# EAGLE design PSD5V (EAGLE 9.6.2)
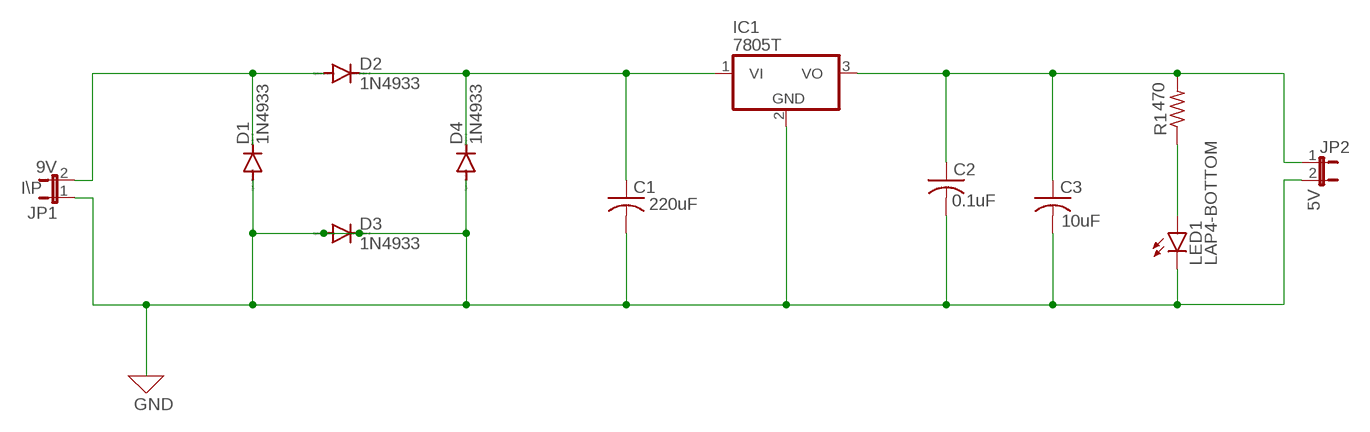
[diagram p0: schematic, sheet 1]

## Parts
C1  C-US025-024X044  [C025-024X044]
C2  C-US025-024X044  [C025-024X044]
C3  C-US025-024X044  [C025-024X044]
D1  1N4933  [DO41-10]
D2  1N4933  [DO41-10]
D3  1N4933  [DO41-10]
D4  1N4933  [DO41-10]
IC1  7805T  [TO220H]
JP1  JP1E  [JP1]
JP2  JP1E  [JP1]
LED1  LAP4-BOTTOM  [P47F-BOTTOM]
R1  R-US_0204/7  [0204/7]

## Nets
0: C1.2 C2.2 C3.2 D1.A D3.A D3.C D4.A IC1.2(GND) JP1.1 JP2.2 LED1.C ; supply symbol labelled GND
N$1: D1.C D2.A JP1.2
N$2: LED1.A R1.1
N$4: C2.1 C3.1 IC1.3(VO) JP2.1 R1.2
N$5: C1.1 D2.C D4.C IC1.1(VI)

## Notes on the sheet
- 470
- 9V
- I\P
- 220uF | 0.1uF | 5V
- 10uF
- GND

## Library data of the parts
C1-C3 = rcl:C-US: CAPACITOR, American symbol; SPICEPREFIX: C
D1-D4 = diode:1N4933: DIODE fast recovery rectifier, 1A
IC1 = linear:78*: Positive VOLTAGE REGULATOR Source: http://cache.national.com/ds/LM/LM78L05.pdf http://www.fairchildsemi.com/ds/LM/LM7805.pdf
JP1 JP2 = jumper:JP1E: JUMPER
LED1 = led:*P4: PointLED® Enhanced Thinfilm LED TOP & BOTTOM mount LS P47F, LR P47F, LA P47F, LY P47F, LT P4SG, LB P4SG, LW P4SG Source: http://catalog.osram-os.com .. LA_LR_LS_LY_P47F_Pb_free.pdf
R1 = rcl:R-US_: RESISTOR, American symbol; SPICEPREFIX: R

## Board
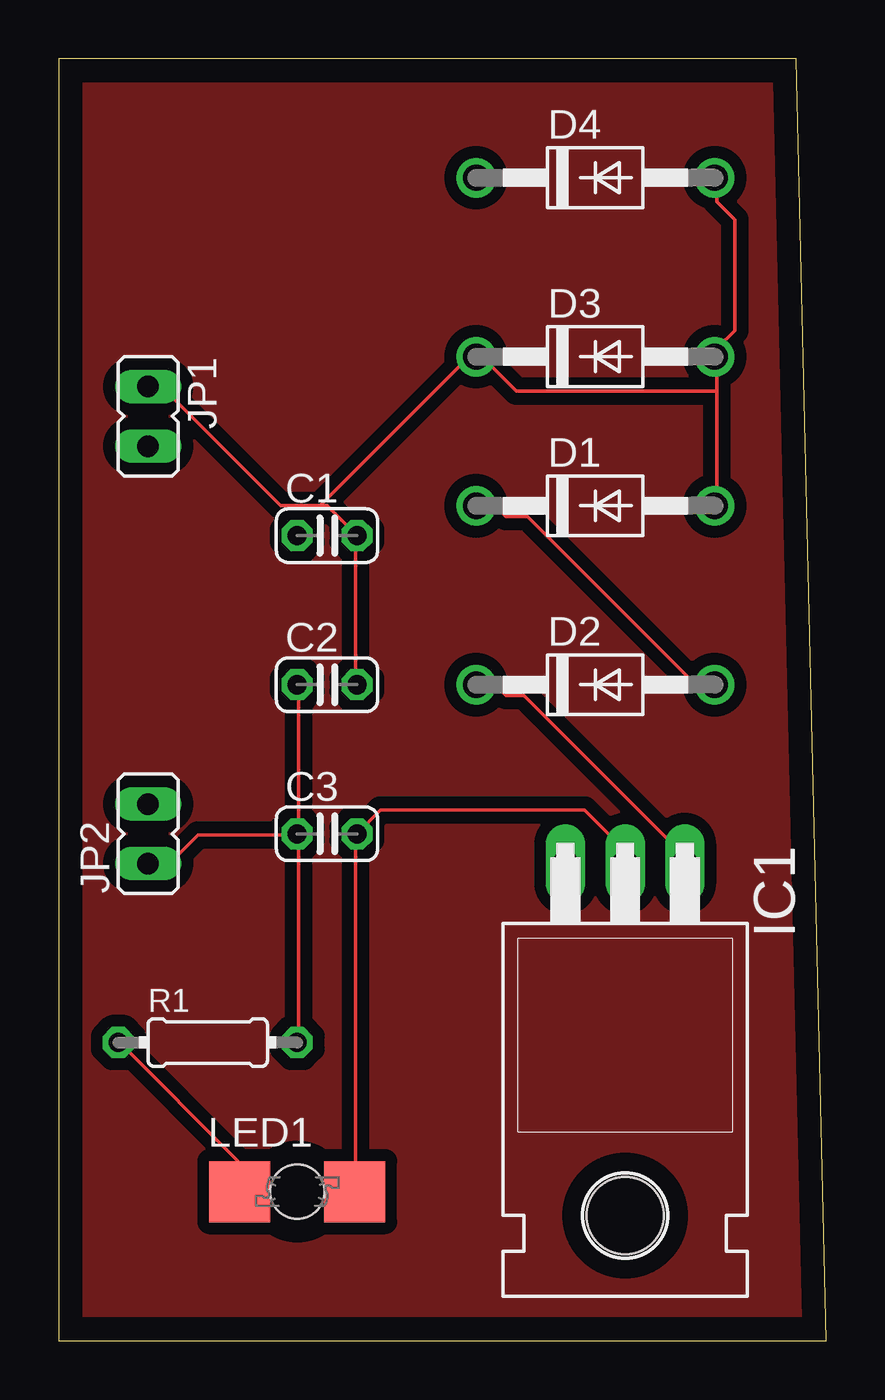
[diagram p1: board, top side]
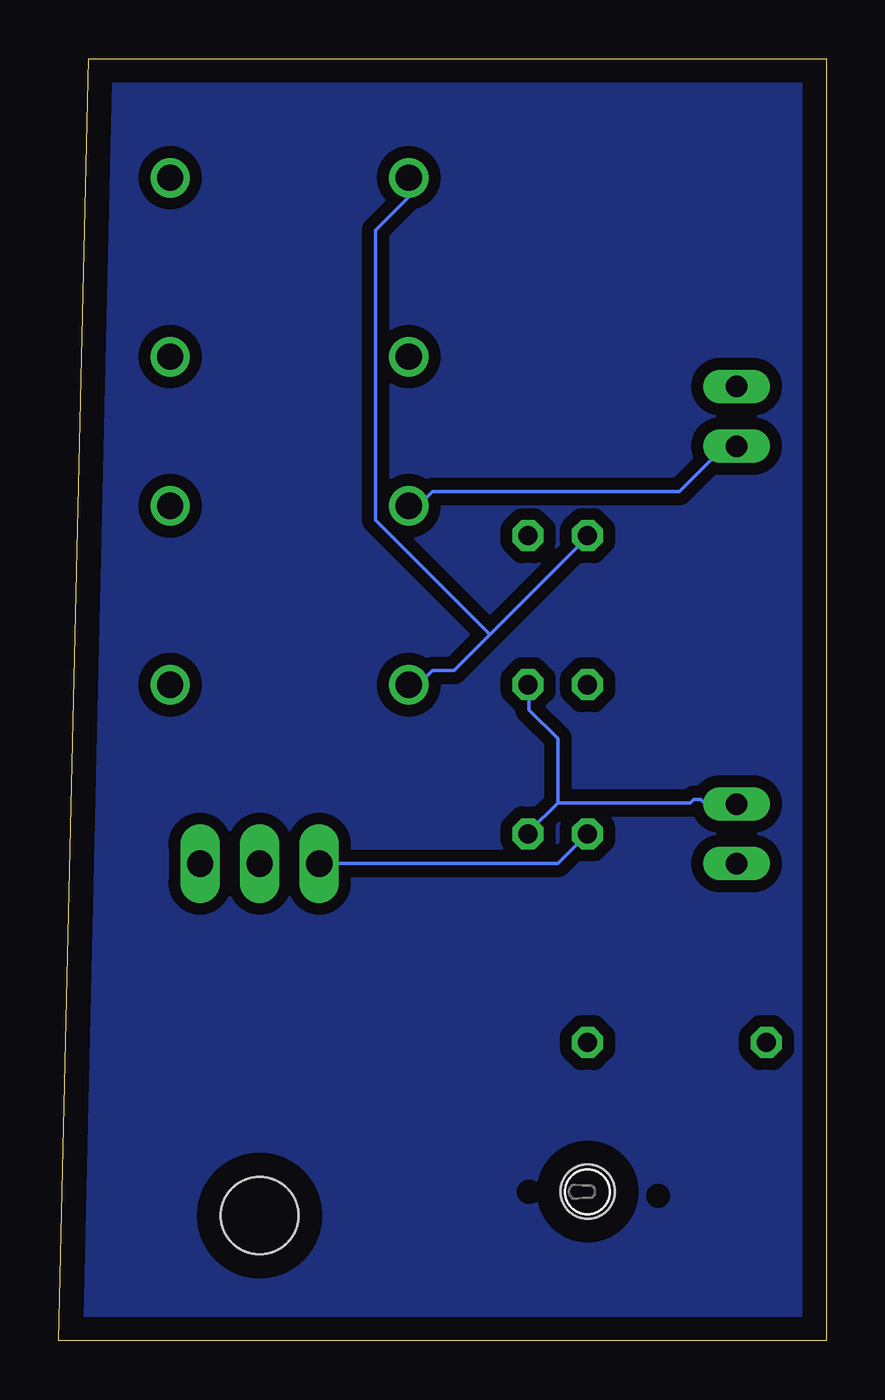
[diagram p2: board, bottom side, seen from below]

Size 32.69 x 54.6 mm. Coordinates in mm from the lower left corner, seen from the top.
Outline: 0,0 32.69,0 31.42,54.6 0,54.6 0,0
Copper layers (1*16): Top 0.035mm / dielectric 1.5mm / Bottom 0.035mm
Design rules "default *": minimum track width 6mil, minimum drill 0.35mm, track to track 20mil, track to pad 20mil, pad to pad 20mil, via to via 20mil, smd to smd 6mil, copper to edge 40mil, drill to drill 6mil, minimum pad ring 10mil, minimum via ring 8mil, stop-mask expansion 4mil, vias tented up to drill 0mil, thermal gap 10mil

### Footprints (pad centres in the part's own frame; a part is rotated, then mirrored left to right if it is on the bottom)
C025-024X044 = drill 0.813 octagon: 1 -1.27,0; 2 1.27,0
DO41-10 = drill 1.118: A 5.08,0; C -5.08,0
TO220H = drill 1.118 long: 1 -2.54,-10.16; 2 0,-10.16; 3 2.54,-10.16 | hole 3.302: 0,4.826
JP1 = drill 0.914 long: 1 0,-1.27; 2 0,1.27
P47F-BOTTOM = smd 2.6 x 2.6: A -2.45,0; C 2.45,0 | hole 2.3: 0,0
0204/7 = drill 0.813 octagon: 1 -3.81,0; 2 3.81,0

### Placement (x,y rotation side)
C1  11.43,34.29 0 top
C2  11.43,27.94 0 top
C3  11.43,21.59 0 top
D1  22.86,35.56 0 top
D2  22.86,27.94 0 top
D3  22.86,41.91 0 top
D4  22.86,49.53 0 top
IC1  24.13,10.16 180 top
JP1  3.81,39.37 180 top
JP2  3.81,21.59 0 top
LED1  10.16,6.35 0 top
R1  6.35,12.7 0 top

### Tracks (layer width: path | path; a pad name or v marks a point on that pad's centre or on a via)
0
  Top 0.152: LED1.C 12.65,6.45 12.65,21.54 C3.2 13.72,22.61 22.4,22.61 24.08,20.93 24.08,20.32 IC1.2 | 28.04,40.44 28.04,41.81 D3.A 28.04,41.96 28.04,42.27 28.8,43.03 28.8,47.75 28.04,48.51 28.04,49.43 D4.A | 28.04,40.44 28.04,35.56 D1.A | C2.2 12.65,27.94 12.65,34.19 C1.2 11.43,35.56 11.12,35.56 | 11.12,35.56 9.45,35.56 4.42,40.59 3.81,40.59 JP1.1 | 11.12,35.56 17.37,41.81 17.68,41.81 D3.C 17.83,41.81 18.14,41.81 19.51,40.44 28.04,40.44
  Bottom 0.152: 11.43,22.91 5.79,22.91 5.64,23.06 5.33,23.06 5.18,22.91 3.81,22.91 JP2.2 | 11.43,22.91 12.65,21.69 C3.2 | 11.43,22.91 11.43,25.65 12.65,26.87 12.65,27.94 C2.2
GND
  pour Top: 0,54.61 31.75,54.61 31.75,0 0,0
  pour Bottom: 0,54.61 31.75,54.61 31.75,0 0,0
N$1
  Top 0.152: D2.A 27.13,27.94 19.96,35.1 19.05,35.1 18.59,35.56 D1.C
  Bottom 0.152: D1.C 17.37,35.56 16.76,36.17 6.25,36.17 4.42,38 3.81,38 JP1.2
N$2
  Top 0.152: LED1.A 7.62,6.45 7.62,7.67 2.59,12.7 R1.1
N$4
  Top 0.152: R1.2 10.21,12.7 10.21,21.54 C3.1 | C2.1 10.21,27.94 10.21,21.69 C3.1 | JP2.1 4.72,20.32 5.94,21.54 10.06,21.54 C3.1
  Bottom 0.152: IC1.3 11.43,20.32 C3.1
N$5
  Top 0.152: IC1.1 26.67,20.62 19.81,27.48 19.05,27.48 18.59,27.94 D2.C
  Bottom 0.152: 14.33,30.07 15.85,28.55 16.76,28.55 17.37,27.94 D2.C | 14.33,30.07 10.21,34.19 C1.1 | 14.33,30.07 19.2,34.95 19.2,47.3 17.83,48.67 17.83,49.43 D4.C